# Altium schematic sheet STM3205P_Measure.SchDoc
size A3; Organization: Canis Tech; Address1: -; Address2: -; Address3: -; Address4: Indaiatuba/SP; Address5: Brazil
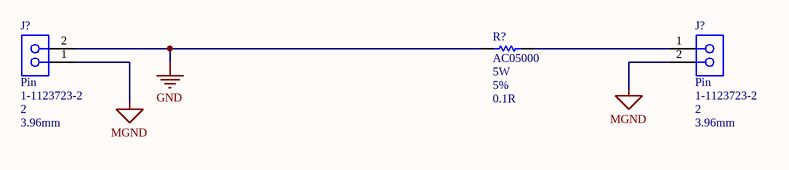
[diagram p0: STM3205P_Measure.SchDoc]

## Parts
(Parts that share a designator on the sheet are numbered #1, #2 ... from top to bottom, then left to right.)
J?#1  Type: Pin  Pins: 2  Pitch: 3.96mm  [CONKK02STRMALE_156]  (hidden comment: 1-1123723-2)
J?#2  Type: Pin  Pins: 2  Pitch: 3.96mm  [CONKK02STRMALE_156]  (hidden comment: 1-1123723-2)
R?  value 0.1R  PartNumber1: AC05000  Power: 5W  Tolerance: 5%  [AC05H]  (hidden comment: AC05)

## Nets
GND: J?#1.2 R?.2
MGND: J?#1.1 J?#2.2
NetJ?#2_1: J?#2.1 R?.1

## Notes on the sheet
- Title
- Author
- Checked By
- Variant
- Size:
- Revision:
- A3
- Date:
- Project
- Time:
- Sheet
- of
- File:

## Library data of the parts
J?#1 J?#2 = 1-1123723-2: Header Vert 3.96mm 2Pos; Manufacturer1: TE Connectivity; LastRevisionNote: Created; Gender: Male; Published: 16-Aug-2025; LatestRevisionDate: 16-Aug-2025; PackageReference: CONKK02STRMALE_156; Publisher: Lucas Moraes; PackageDescription: CONKK02STRMALE_156; 2 Leads; PartNumber1: 1-1123723-2
R? = AC05: Power Metal Film Leaded Resistors; Published: 17-Apr-2021; LatestRevisionDate: 17-Apr-2021; PackageReference: AC05; Publisher: Lucas Moraes; PackageDescription: AC05; 2 Leads